# Altium schematic sheet Perifericos.SchDoc: Sanhaço - Periféricos
size A4; DocumentNumber: CB04; Revision: 1.1; SheetNumber: 4; SheetTotal: 4; ProjectName: Sanhaço
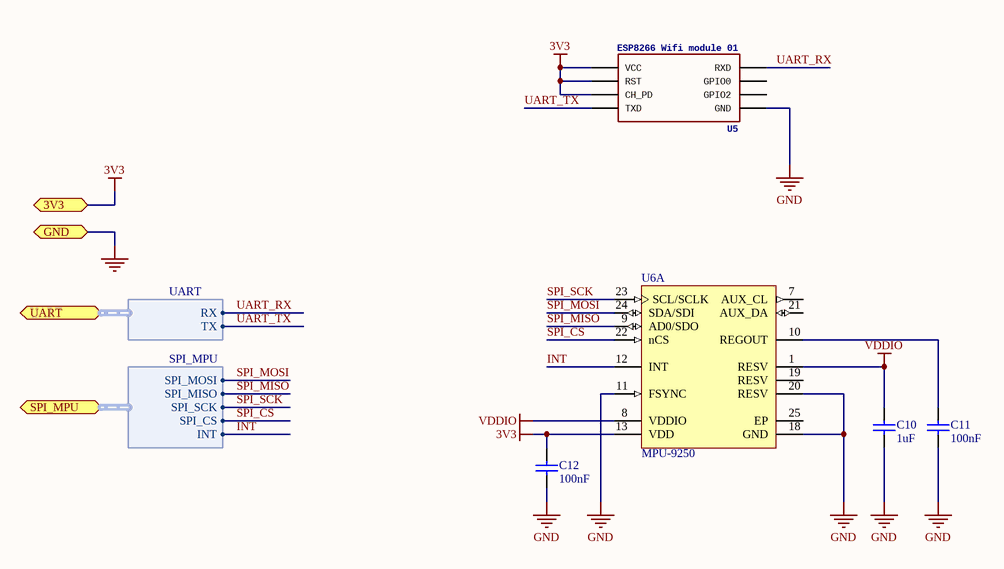
[diagram p0: Perifericos.SchDoc]

## Parts
C10  1uF  [CAPC0603(1608)100_L]
C11  100nF  [CAPC0402(1005)60_L]
C12  100nF  [CAPC0402(1005)60_L]
U5  ESP8266 Wifi module 01  [ESP01]
U6  MPU-9250  [INSE-QFN-24-1700X1540TP_L]  (part A of 2)

## Ports
3V3, GND, SPI_MPU (harness SPI_MPU), UART (harness UART)

## Harnesses
UART: RX, TX
SPI_MPU: SPI_MOSI, SPI_MISO, SPI_SCK, SPI_CS, INT

## Nets
0: port GND
3V3: C12.2 U5.CH_PD U5.RST U5.VCC U6.13(VDD) ; port 3V3
GND: C10.1 C11.1 C12.1 U5.GND U6.11(FSYNC) U6.18(GND) U6.20(RESV)
VDDIO: C10.2 U6.1(RESV) U6.8(VDDIO)
INT: U6.12(INT) ; port SPI_MPU.INT
SPI_CS: U6.22(nCS) ; port SPI_MPU.SPI_CS
SPI_MISO: U6.9(AD0/SDO) ; port SPI_MPU.SPI_MISO
SPI_MOSI: U6.24(SDA/SDI) ; port SPI_MPU.SPI_MOSI
SPI_SCK: U6.23(SCL/SCLK) ; port SPI_MPU.SPI_SCK
UART_RX: U5.RX(RXD) ; port UART.RX
UART_TX: U5.TX(TXD) ; port UART.TX
NetC11_2: C11.2 U6.10(REGOUT)

Not connected (* = marked no-connect by the designer): U5 GPIO0 GPIO2; U6 7(AUX_CL) 19(RESV) 21(AUX_DA) 25(EP)

## Notes on the sheet
- Title
- Size:
- Date:
- A4
- Number:
- Time:
- Revision:
- Sheet
- of
- File:

## Library data of the parts
C10 = CMP-1035-02740-1: CAP 1uF 25V ±10% 0603 (1608 Metric) Thickness 1mm SMD; Tolerance: Â±10%; Case-Metric: 1608; Case-EIA: 0603; Technology: SMT; Rated Voltage: 25 V; Max Thickness: 1 mm; Value: 1uF
C11 C12 = CMP-1034-02072-1: CAP 100nF 25V ±10% 0402 (1005 Metric) Thickness 0.6mm SMD; Case-EIA: 0402; Tolerance: Â±10%; Case-Metric: 1005; Technology: SMT; Value: 100nF; Rated Voltage: 25 V; Max Thickness: 0.6 mm
U5 = ESP01: GateName_1: G$1; SymbolName_1: ESP01; LibraryName: esp8266modules; DeviceSetName: ESP01; Package: ESP01
U6 = CMP-2100-03657-1: 9-axis MotionTracking device, 2.4 to 3,6 V, -40 to 85 degC, 24-Pin QFN, RoHS, Tape and Reel; Manufacturer: InvenSense; Max Supply Voltage: 3.6V; Min Supply Voltage: 2.4V; Package Reference: QFN-24; Package Quantity: 1; Datasheet Version: Rev. 1.0, 01/2014; Case/Package: QFN; Package Description: 24-Pin Quad Flat No-lead Package, Body 3 x 3 mm, Pitch 0.4 mm; Datasheet URL: http://datasheet.octopart.com/MPU-9250-InvenSense-datasheet-21859386.pdf; RoHSCompliant: true; Max Operating Temperature: 85degC; Height: 1mm; Mount: SurfaceMount; Manufacturer URL: http://www.invensense.com/; Width: 3.1mm; Min Operating Temperature: -40degC; Length: 3.1mm